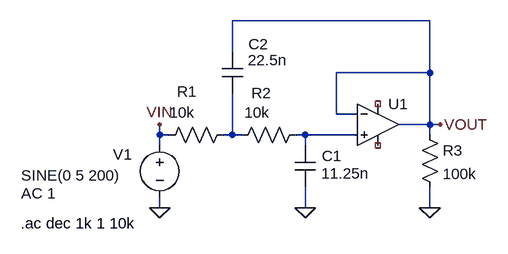
[diagram p0: schematic Low_Pass_Filter.asc]
Low_Pass_Filter.asc, the LTspice schematic file:
Version 4
SHEET 1 880 680
WIRE 240 48 -64 48
WIRE -64 96 -64 48
WIRE 240 128 240 48
WIRE 240 128 96 128
WIRE 96 192 96 128
WIRE 128 192 96 192
WIRE 240 208 240 128
WIRE 240 208 192 208
WIRE 256 208 240 208
WIRE -176 224 -176 208
WIRE -160 224 -176 224
WIRE -64 224 -64 160
WIRE -64 224 -80 224
WIRE -48 224 -64 224
WIRE 48 224 32 224
WIRE 128 224 48 224
WIRE 240 224 240 208
WIRE -176 240 -176 224
WIRE 48 240 48 224
WIRE -176 336 -176 320
WIRE 48 336 48 304
WIRE 240 336 240 304
FLAG -176 336 0
FLAG 48 336 0
FLAG 240 336 0
FLAG -176 208 VIN
FLAG 256 208 VOUT
SYMBOL OpAmps\\UniversalOpAmp 160 208 R0
SYMATTR InstName U1
SYMBOL voltage -176 224 R0
WINDOW 0 -72 30 Left 2
WINDOW 3 -213 62 Left 2
WINDOW 123 -213 90 Left 2
WINDOW 39 0 0 Left 0
SYMATTR InstName V1
SYMATTR Value SINE(0 5 200)
SYMATTR Value2 AC 1
SYMBOL res -64 208 R90
WINDOW 0 -35 70 VBottom 2
WINDOW 3 -34 77 VTop 2
SYMATTR InstName R1
SYMATTR Value 10k
SYMBOL res 48 208 R90
WINDOW 0 -33 67 VBottom 2
WINDOW 3 -34 74 VTop 2
SYMATTR InstName R2
SYMATTR Value 10k
SYMBOL cap 32 240 R0
WINDOW 0 42 16 Left 2
WINDOW 3 41 43 Left 2
SYMATTR InstName C1
SYMATTR Value 11.25n
SYMBOL cap -80 96 R0
WINDOW 0 41 -12 Left 2
WINDOW 3 40 13 Left 2
SYMATTR InstName C2
SYMATTR Value 22.5n
SYMBOL res 224 208 R0
SYMATTR InstName R3
SYMATTR Value 100k
TEXT -390 360 Left 2 !.ac dec 1k 1 10k

The netlist it stands for:
* Low_Pass_Filter.asc
XU1 N002 VOUT NC_01 NC_02 VOUT level1 Avol=1Meg GBW=10Meg Vos=0 En=0 Enk=0 In=0 Ink=0 Rin=500Meg  ; pins In+ In- V+ V- OUT
V1 VIN 0 SINE(0 5 200) AC 1
R1 N001 VIN 10k
R2 N002 N001 10k
C1 N002 0 11.25n
C2 VOUT N001 22.5n
R3 VOUT 0 100k
.ac dec 1k 1 10k
.lib UniversalOpAmp1.lib
.backanno
.end